# EAGLE design dash-dock (EAGLE 8.4.3)
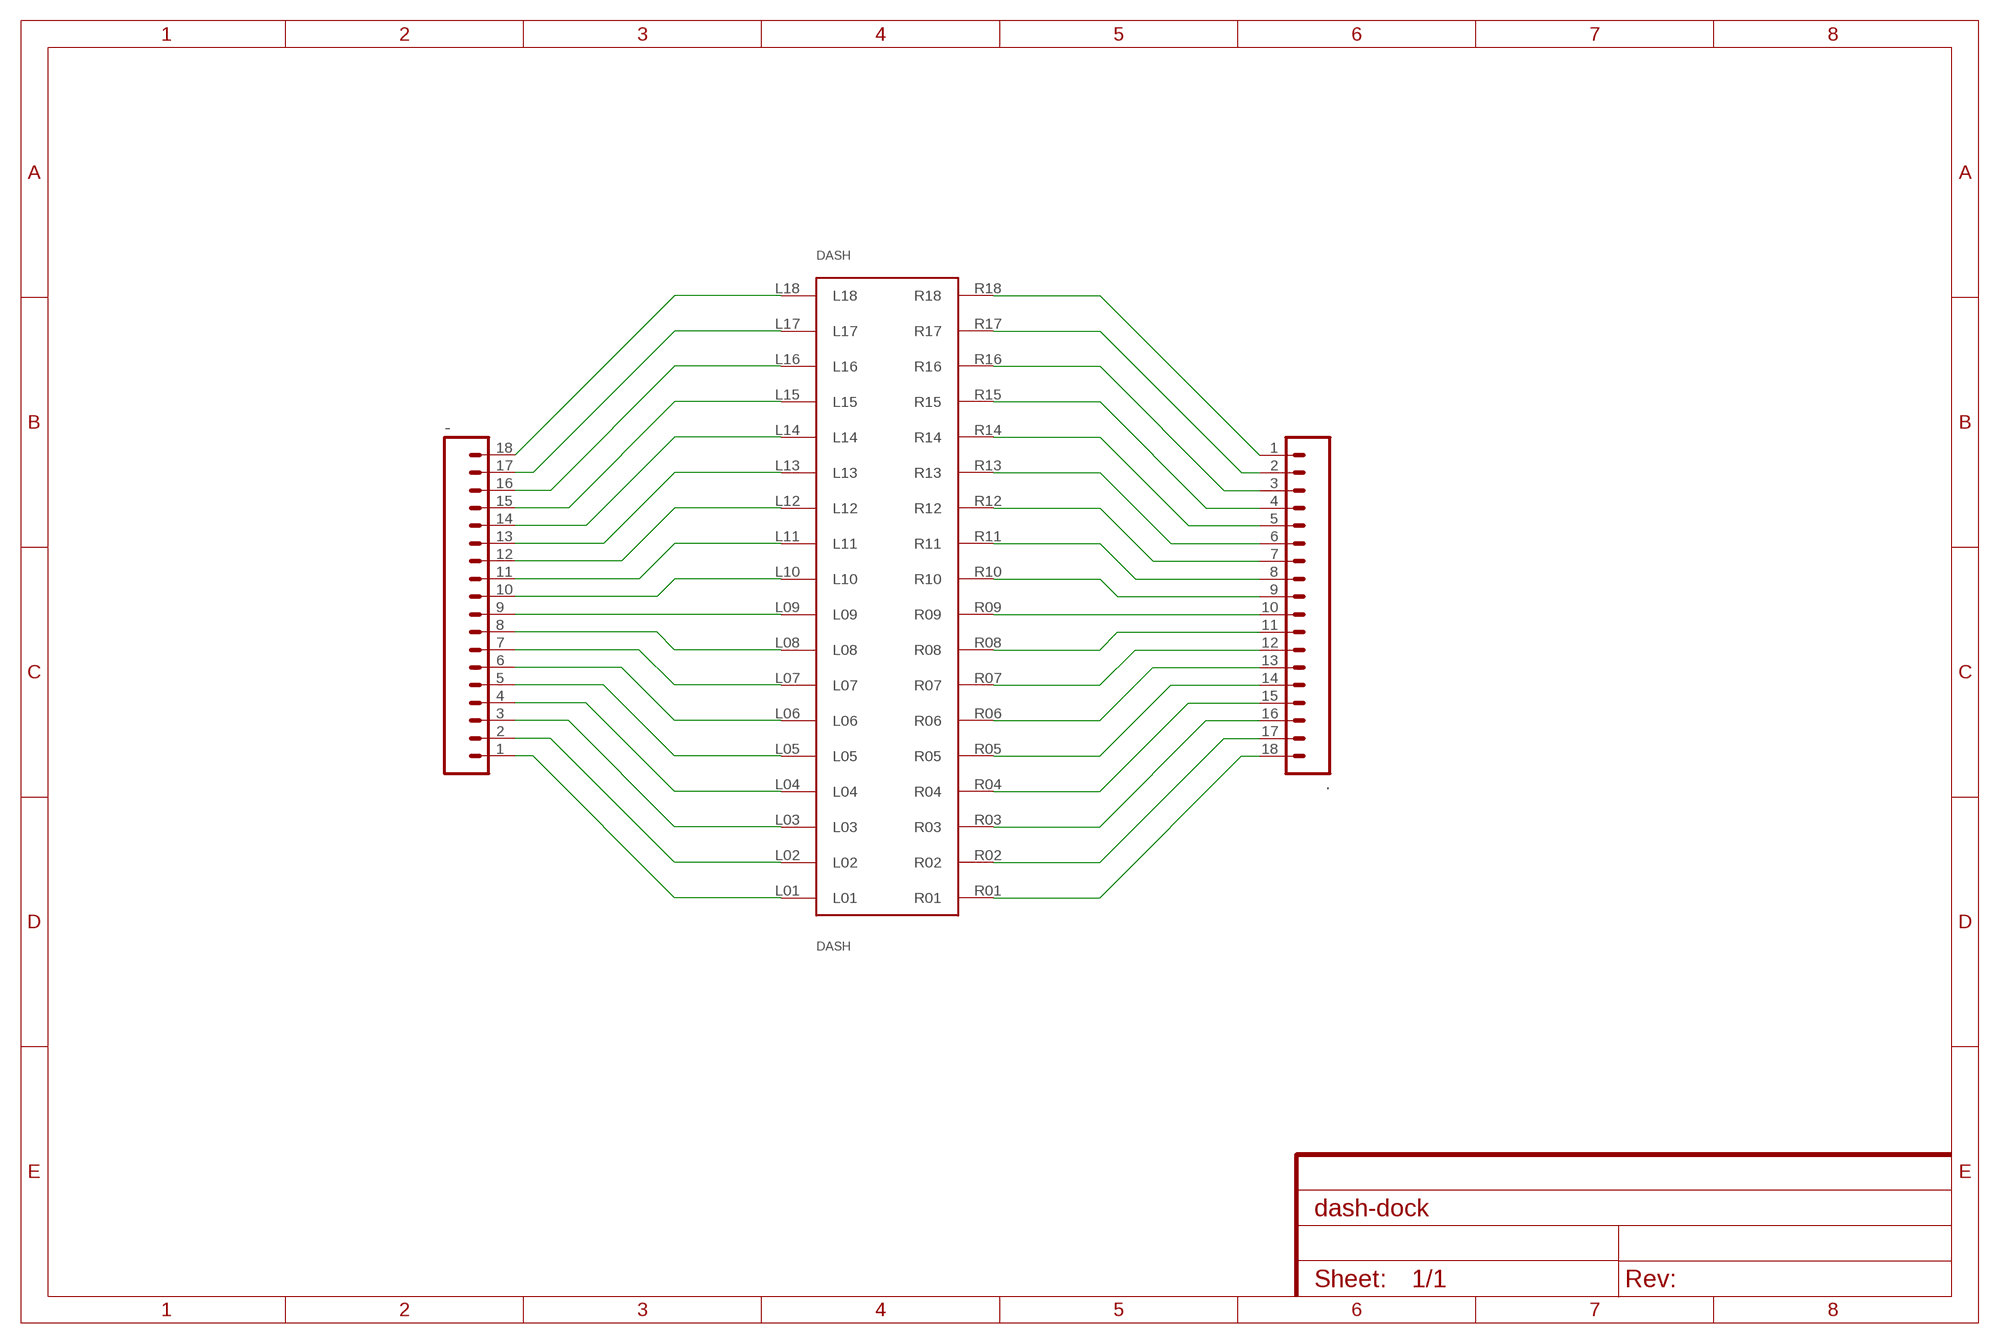
[diagram p0: schematic, sheet 1]

## Parts
-  CONN_18  [1X18]
.  CONN_18  [1X18]
DASH  DASH  [DASH]

## Nets
GND: -.2 ..17 DASH.L02 DASH.R02
N$1: -.9 DASH.L09
N$2: -.10 DASH.L10
N$3: -.11 DASH.L11
N$4: -.12 DASH.L12
N$5: -.13 DASH.L13
N$6: -.14 DASH.L14
N$7: -.15 DASH.L15
N$8: -.16 DASH.L16
N$9: -.17 DASH.L17
N$10: -.18 DASH.L18
N$11: -.8 DASH.L08
N$12: -.7 DASH.L07
N$13: -.6 DASH.L06
N$14: -.5 DASH.L05
N$15: -.4 DASH.L04
N$16: -.3 DASH.L03
N$18: -.1 DASH.L01
N$19: ..10 DASH.R09
N$20: ..9 DASH.R10
N$21: ..8 DASH.R11
N$22: ..7 DASH.R12
N$23: ..6 DASH.R13
N$24: ..5 DASH.R14
N$25: ..4 DASH.R15
N$26: ..3 DASH.R16
N$27: ..2 DASH.R17
N$28: ..1 DASH.R18
N$29: ..11 DASH.R08
N$30: ..12 DASH.R07
N$31: ..13 DASH.R06
N$32: ..14 DASH.R05
N$33: ..15 DASH.R04
N$34: ..16 DASH.R03
N$36: ..18 DASH.R01

## Library data of the parts
- . = SparkFun-Connectors:CONN_18: Multi connection point. Often used as Generic Header-pin footprint for 0.1 inch spaced/style header connections On any of the 0.1 inch spaced packages, you can populate with these: Break Away Headers - Straight <https://www.sparkfun.com/products/116> (PRT-00116) Break Away Male Headers - Right Angle <https://www.sparkfun.com/products/553> (PRT-00553) Female Headers <https://www.sparkfun.com/products/115> (PRT-00115) Break Away Headers - Machine Pin <https://www.sparkfun.com/products/117> (PRT-00117) Break Away Female Headers - Swiss Machine Pin <https://www.sparkfun.com/products/743> (PRT-00743) For SCREWTERMINALS and SPRING TERMINALS visit here: Screw Terimnals on SparkFun.com <https://www.sparkfun.com/search/results?term=Screw+Terminals> (5mm/3.5mm/2.54mm spacing) This device is also useful as a general connection point to wire up your design to another part of your project. Our various solder wires solder well into these plated through hole pads. Hook-Up Wire - Assortment (Stranded, 22 AWG) <https://www.sparkfun.com/products/11375> (PRT-11375) Hook-Up Wire - Assortment (Solid Core, 22 AWG) <https://www.sparkfun.com/products/11367> (PRT-11367) View the entire wire category on our website here <https://www.sparkfun.com/categories/141> Special notes: Molex polarized connector foot print use with SKU : PRT-08231 with associated crimp pins and housings. 1MM SMD Version SKU: PRT-10208 NOTES ON THE VARIANTS LOCK and LOCK_LONGPADS... This footprint was designed to help hold the alignment of a through-hole component (i.e. 6-pin header) while soldering it into place. You may notice that each hole has been shifted either up or down by 0.005 of an inch from it's more standard position (which is a perfectly straight line). This slight alteration caused the pins (the squares in the middle) to touch the edges of the holes. Because they are alternating, it causes a "brace" to hold the component in place. 0.005 has proven to be the perfect amount of "off-center" position when using our standard breakaway headers. Although looks a little odd when you look at the bare footprint, once you have a header in there, the alteration is very hard to notice. Also,if you push a header all the way into place, it is covered up entirely on the bottom side.
DASH = dash-km:DASH

## Board
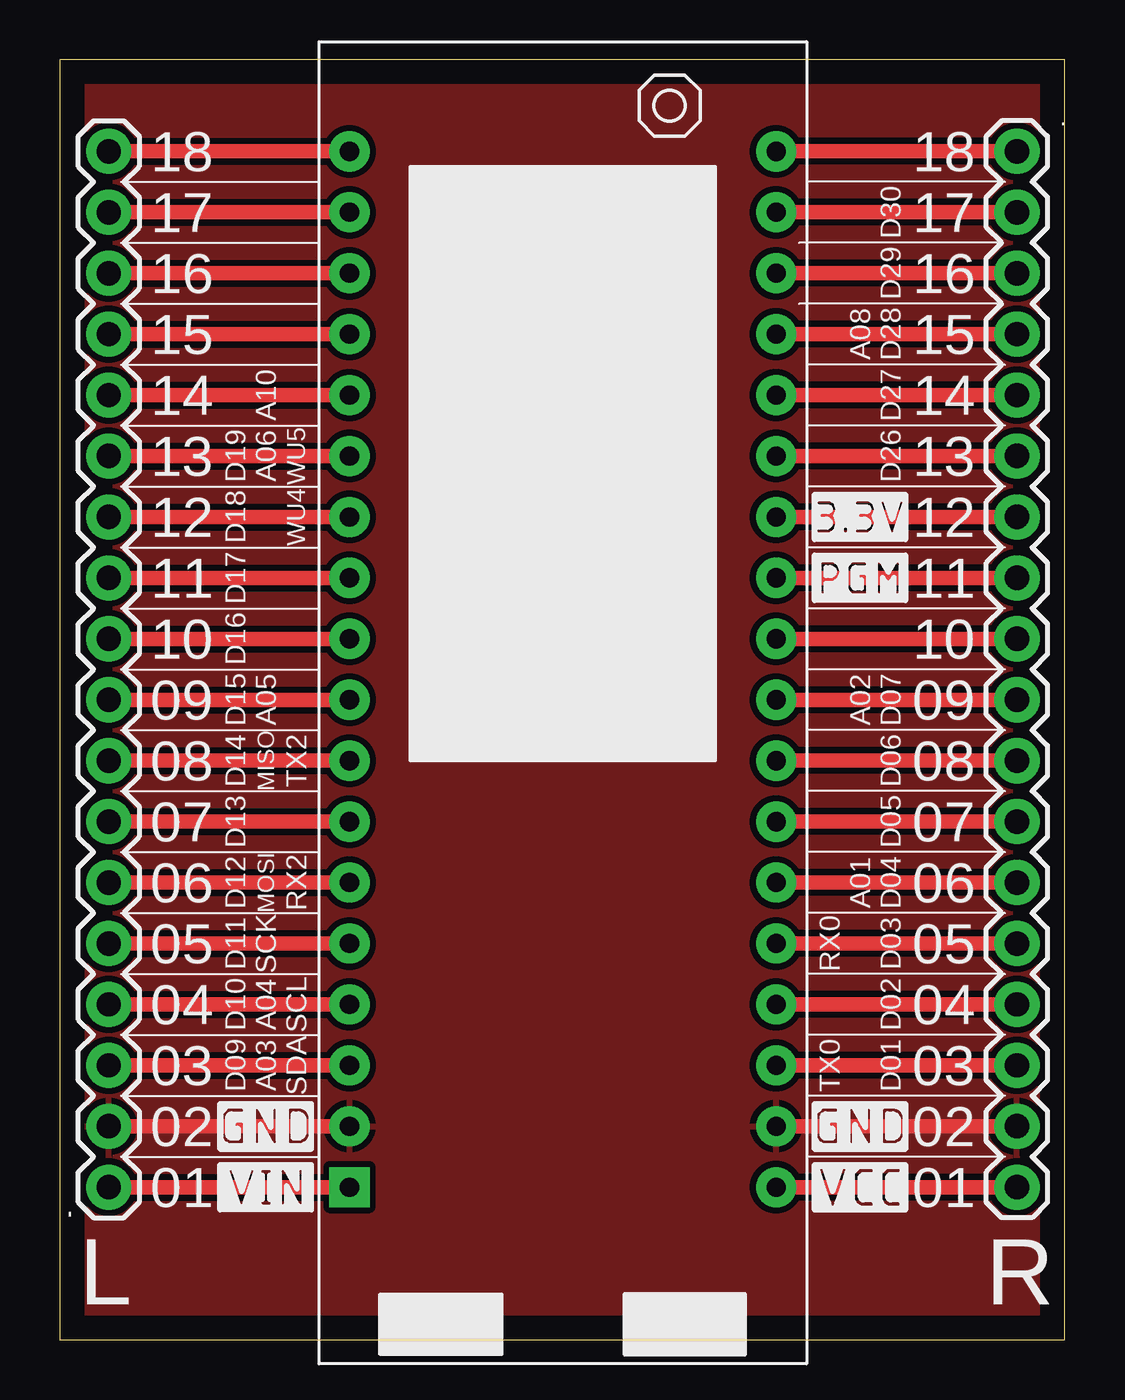
[diagram p1: board, top side]
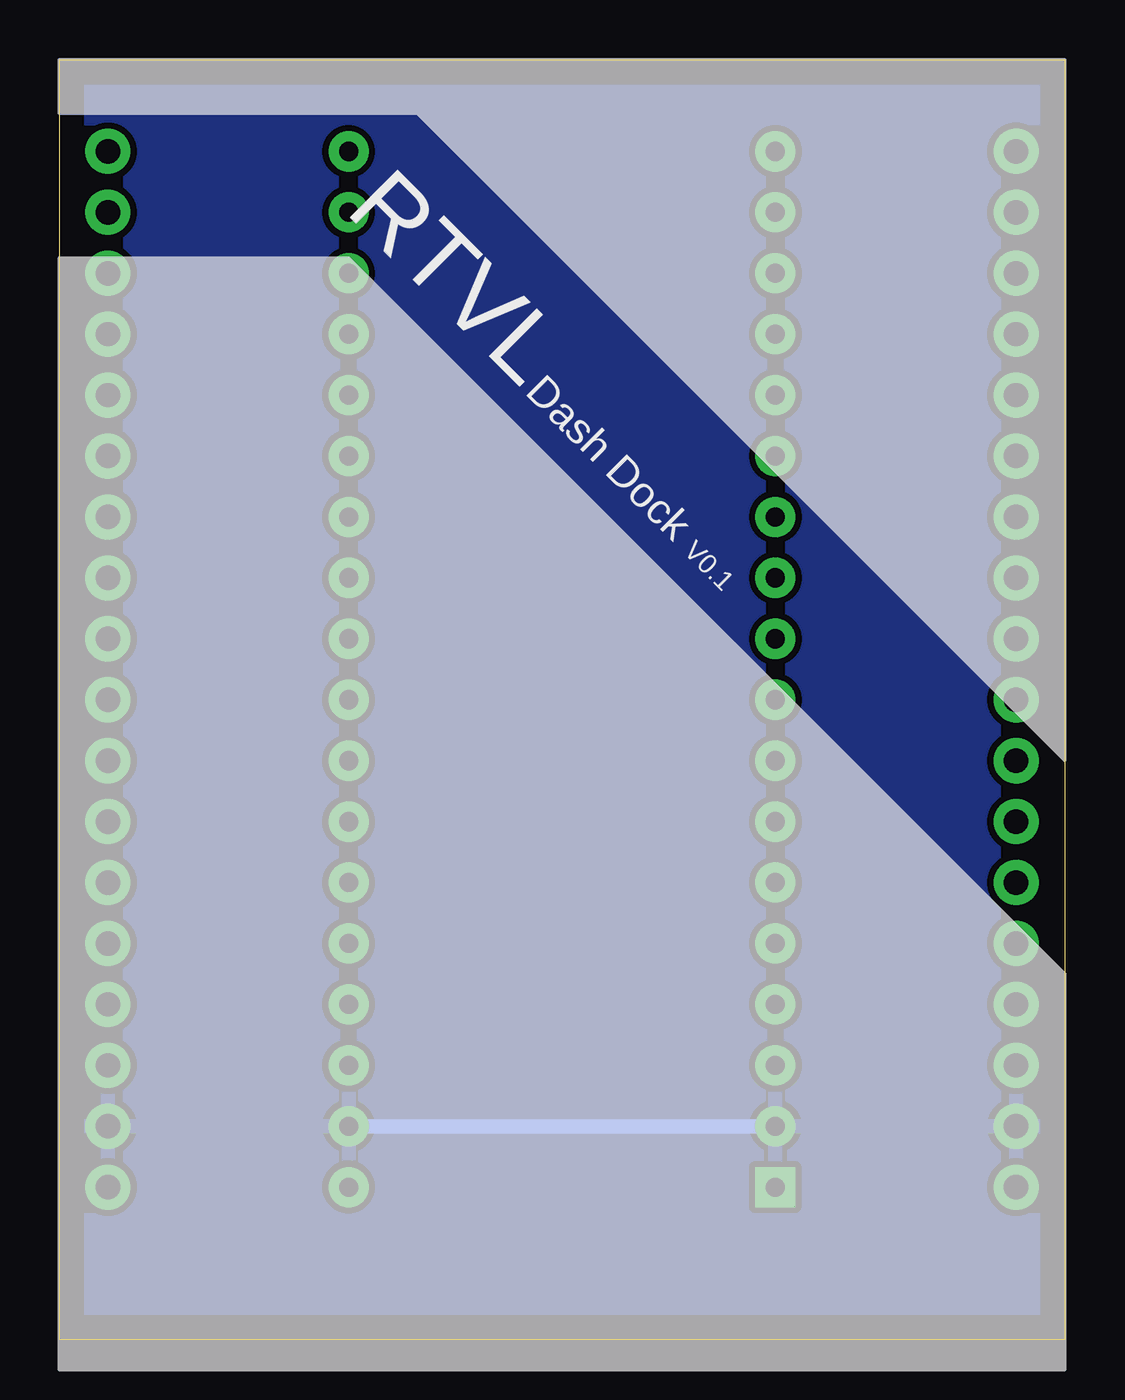
[diagram p2: board, bottom side, seen from below]

Size 41.87 x 53.34 mm. Coordinates in mm from the lower left corner, seen from the top.
Outline: 0,0 41.87,0 41.87,53.34 0,53.34 0,0
Copper layers (1*16): Top 0.035mm / dielectric 1.5mm / Bottom 0.035mm
Design rules "default": minimum track width 6mil, minimum drill 0.35mm, track to track 6mil, track to pad 6mil, pad to pad 6mil, via to via 6mil, smd to smd 6mil, copper to edge 40mil, drill to drill 6mil, minimum pad ring 10mil, minimum via ring 8mil, stop-mask expansion 4mil, vias tented up to drill 0mil, thermal gap 10mil

### Footprints (pad centres in the part's own frame; a part is rotated, then mirrored left to right if it is on the bottom)
1X18 = drill 1.016 pad 1.88: 1 0,0; 2 2.54,0; 3 5.08,0; 4 7.62,0; 5 10.16,0; 6 12.7,0; 7 15.24,0; 8 17.78,0; 9 20.32,0; 10 22.86,0; 11 25.4,0; 12 27.94,0; 13 30.48,0; 14 33.02,0; 15 35.56,0; 16 38.1,0; 17 40.64,0; 18 43.18,0
DASH = drill 0.8 pad 1.676 square: L01 47.625,1.27 | drill 0.8 pad 1.676: L02 45.085,1.27; L03 42.545,1.27; L04 40.005,1.27; L05 37.465,1.27; L06 34.925,1.27; L07 32.385,1.27; L08 29.845,1.27; L09 27.305,1.27; L10 24.765,1.27; L11 22.225,1.27; L12 19.685,1.27; L13 17.145,1.27; L14 14.605,1.27; L15 12.065,1.27; L16 9.525,1.27; L17 6.985,1.27; L18 4.445,1.27; R01 47.625,19.05; R02 45.085,19.05; R03 42.545,19.05; R04 40.005,19.05; R05 37.465,19.05; R06 34.925,19.05; R07 32.385,19.05; R08 29.845,19.05; R09 27.305,19.05; R10 24.765,19.05; R11 22.225,19.05; R12 19.685,19.05; R13 17.145,19.05; R14 14.605,19.05; R15 12.065,19.05; R16 9.525,19.05; R17 6.985,19.05; R18 4.445,19.05

### Placement (x,y rotation side)
-  2.03,6.35 90 top
.  39.88,49.53 270 top
DASH  10.79,53.97 270 top

### Tracks (layer width: path | path; a pad name or v marks a point on that pad's centre or on a via)
GND
  Top 0.61: -.2 DASH.L02 | ..17 DASH.R02
  Bottom 0.61: DASH.L02 DASH.R02
  pour Bottom (isolate 0.254): 0,-1.27 41.91,-1.27 41.91,53.97 0,53.97
  pour Top (isolate 0.254): 0,0 0,53.02 41.91,53.02 41.91,0 0.32,0
N$1
  Top 0.61: -.9 DASH.L09
N$2
  Top 0.61: -.10 DASH.L10
N$3
  Top 0.61: -.11 DASH.L11
N$4
  Top 0.61: -.12 DASH.L12
N$5
  Top 0.61: -.13 DASH.L13
N$6
  Top 0.61: -.14 DASH.L14
N$7
  Top 0.61: -.15 DASH.L15
N$8
  Top 0.61: -.16 DASH.L16
N$9
  Top 0.61: -.17 DASH.L17
N$10
  Top 0.61: -.18 DASH.L18
N$11
  Top 0.61: -.8 DASH.L08
N$12
  Top 0.61: -.7 DASH.L07
N$13
  Top 0.61: -.6 DASH.L06
N$14
  Top 0.61: -.5 DASH.L05
N$15
  Top 0.61: -.4 DASH.L04
N$16
  Top 0.61: -.3 DASH.L03
N$18
  Top 0.61: -.1 DASH.L01
N$19
  Top 0.61: ..10 DASH.R09
N$20
  Top 0.61: ..9 DASH.R10
N$21
  Top 0.61: ..8 DASH.R11
N$22
  Top 0.61: ..7 DASH.R12
N$23
  Top 0.61: ..6 DASH.R13
N$24
  Top 0.61: ..5 DASH.R14
N$25
  Top 0.61: ..4 DASH.R15
N$26
  Top 0.61: ..3 DASH.R16
N$27
  Top 0.61: ..2 DASH.R17
N$28
  Top 0.61: ..1 DASH.R18
N$29
  Top 0.61: ..11 DASH.R08
N$30
  Top 0.61: ..12 DASH.R07
N$31
  Top 0.61: ..13 DASH.R06
N$32
  Top 0.61: ..14 DASH.R05
N$33
  Top 0.61: ..15 DASH.R04
N$34
  Top 0.61: ..16 DASH.R03
N$36
  Top 0.61: ..18 DASH.R01

### Text on the board
tPlace: 18 | 18 | 17 | D30 | 17 | 16 | D29 | 16 | 15 | A08 | D28 | 15 | 14 | A10 | D27 | 14 | 13 | D19 | A06 | WU5 | D26 | 13 | 12 | D18 | WU4 | 12 | 11 | D17 | 11 | 10 | D16 | 10 | 09 | D15 | A05 | A02 | D07 | 09 | 08 | D14 | MISO | TX2 | D06 | 08 | 07 | D13 | D05 | 07 | 06 | D12 | MOSI | RX2 | A01 | D04 | 06 | 05 | D11 | SCK | RX0 | D03 | 05 | 04 | D10 | A04 | SCL | D02 | 04 | 03 | D09 | A03 | SDA | TX0 | D01 | 03 | 02 | 02 | 01 | 01 | L | R
bPlace: RTVL | Dash Dock | V0.1